# Altium schematic sheet Lab3Part26.SchDoc
size A
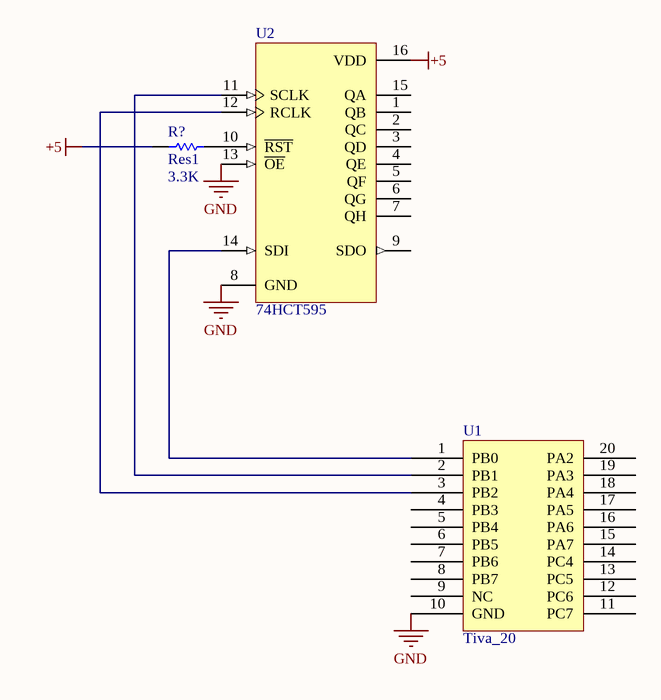
[diagram p0: Lab3Part26.SchDoc]

## Parts
R?  Res1  value 3.3K  [AXIAL-0.3]
U1  Tiva_20
U2  74HCT595  [DIP-16/X1.5]

## Nets
+5: R?.1 U2.16(VDD)
GND: U1.10(GND) U2.8(GND) U2.13(~{OE})
NetR?_2: R?.2 U2.10(~{RST})
NetU1_1: U1.1(PB0) U2.14(SDI)
NetU1_2: U1.2(PB1) U2.11(SCLK)
NetU1_3: U1.3(PB2) U2.12(RCLK)

Not connected (* = marked no-connect by the designer): U1 4(PB3) 5(PB4) 6(PB5) 7(PB6) 8(PB7) 9(NC) 11(PC7) 12(PC6) 13(PC5) 14(PC4) 15(PA7) 16(PA6) 17(PA5) 18(PA4) 19(PA3) 20(PA2); U2 1(QB) 2(QC) 3(QD) 4(QE) 5(QF) 6(QG) 7(QH) 9(SDO) 15(QA)

## Library data of the parts
R? = Res1: Resistor; Manufacturer: Generic Components; Class: Passive; Published: 08/06/2000; Publisher: Altium Hobart Technology Centre; SubClass: Resistor
U1 = Tiva_20: Tiva Protection 20 Pin Connector
U2 = 74xxx595: 8-Bit Serial-Input/Serial or Prallel-Output Shift Register with Latched 3-State Outputs; Manufacturer: ON Semiconductor; Class: Logic; Published: 15/04/2002; Publisher: Altium Hobart Technology Centre; SubClass: Register